# Altium schematic sheet ip_phone_c_codec.SchDoc: CODEC
size A3; Organization: Instituto Atlântico; Address1: Rua Chico Lemos, 946; Address2: Cidade dos Funcionários; Address3: CEP: 60822-780; Address4: Fortaleza - CE; SheetNumber: 3; SheetTotal: 6
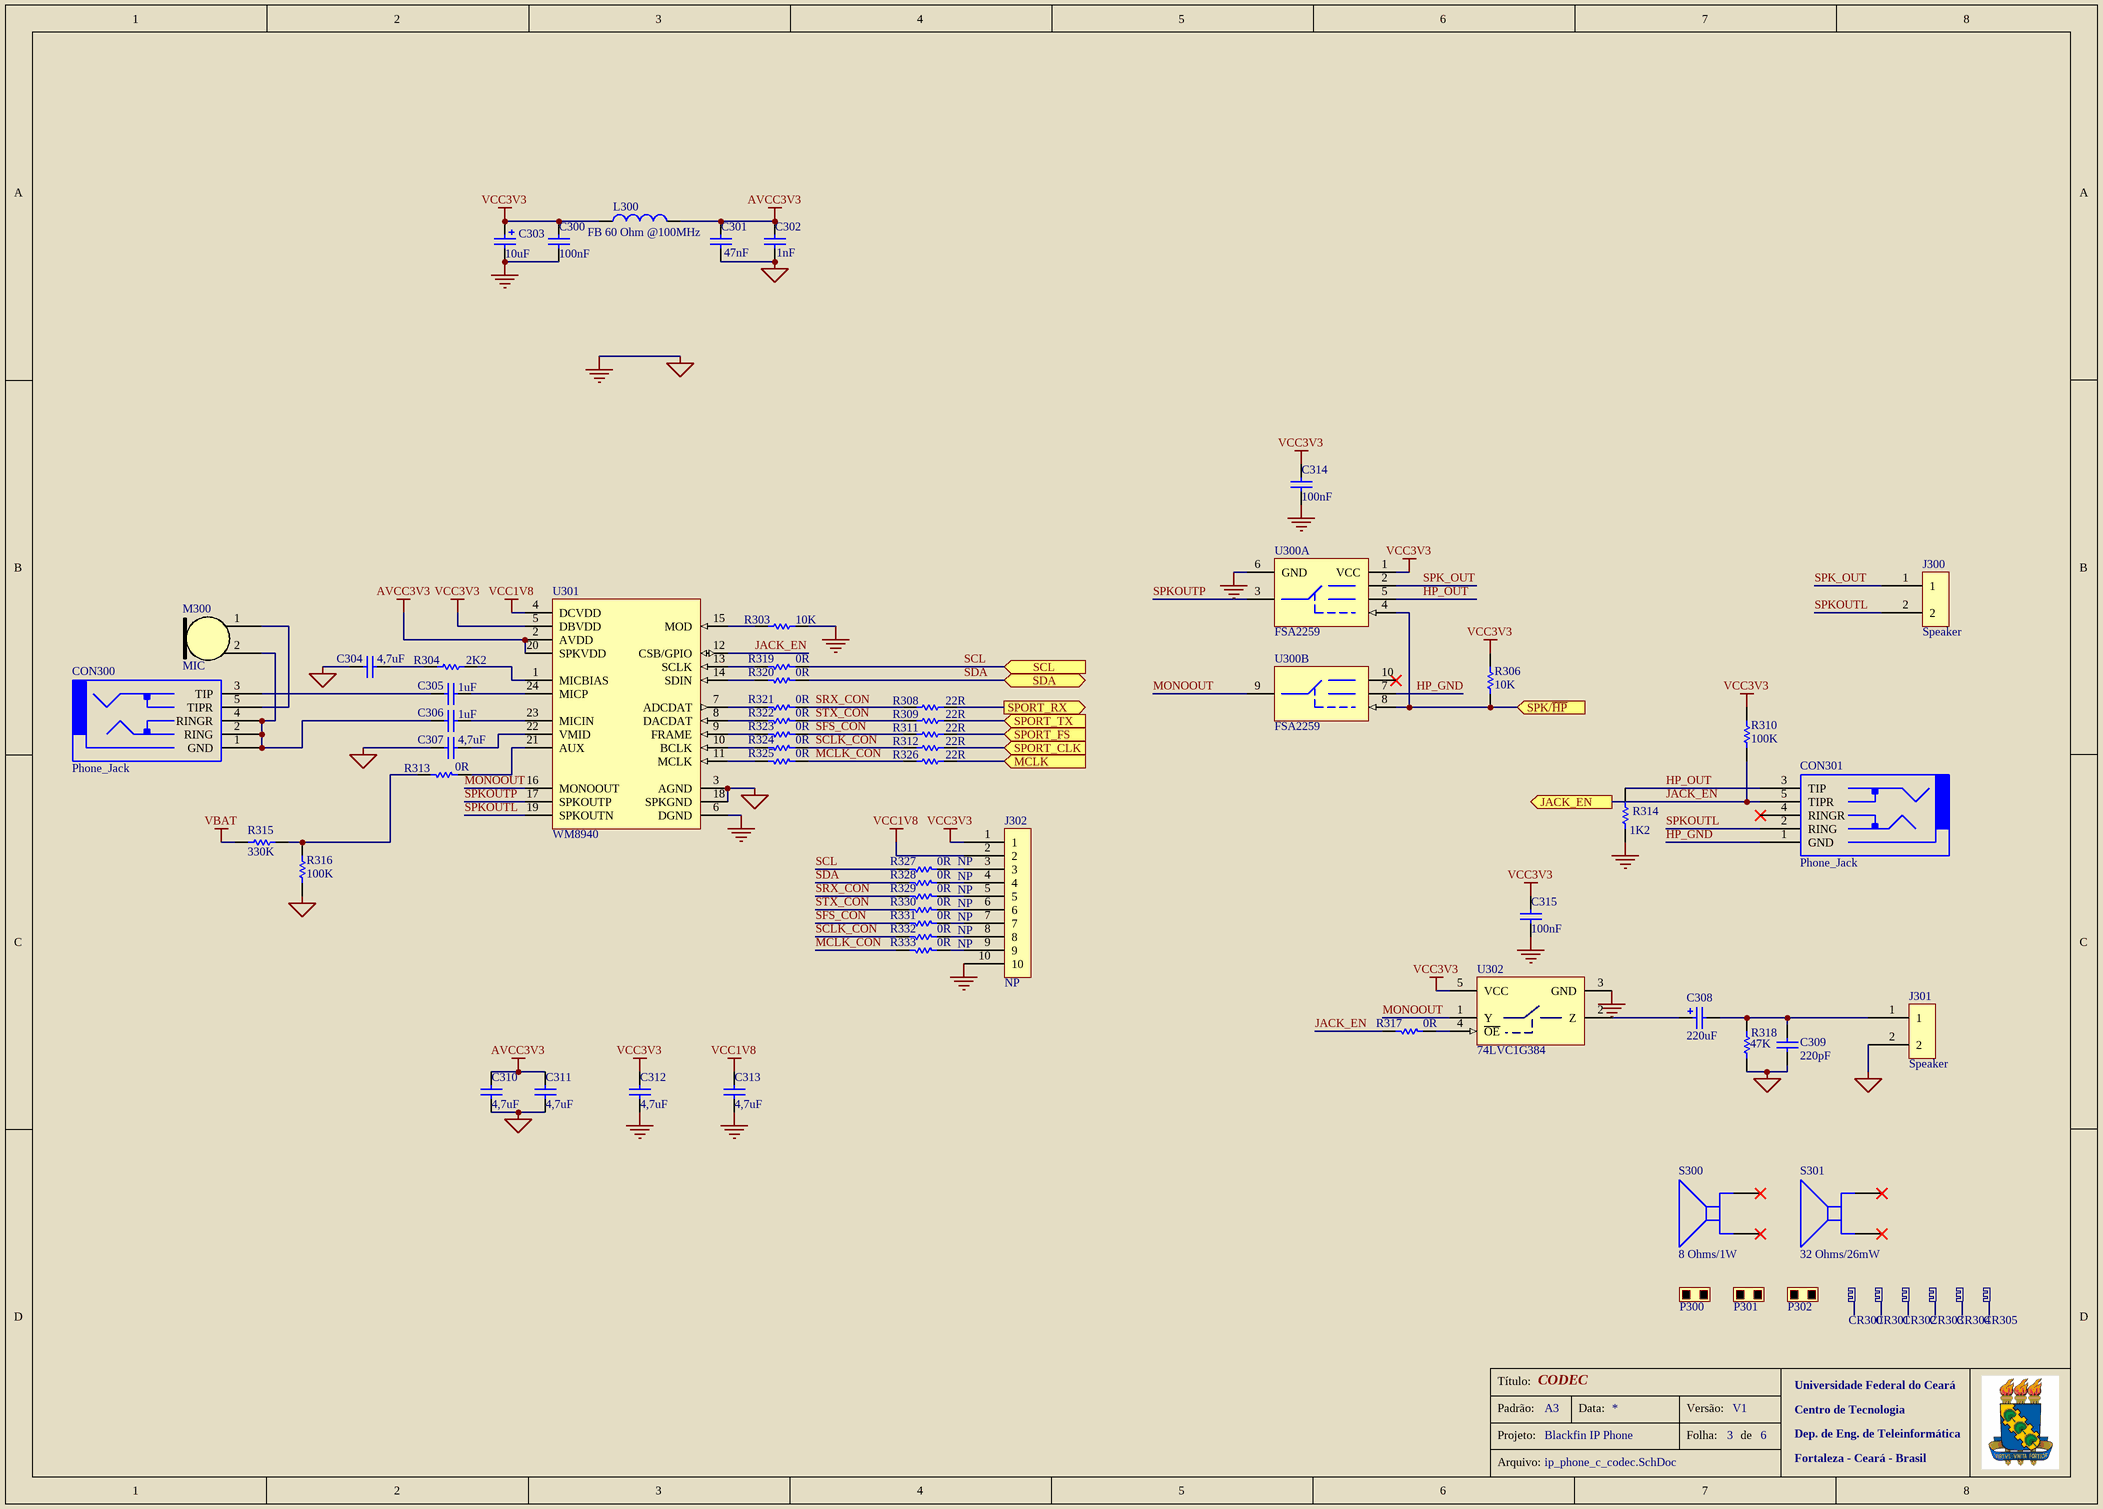
[diagram p0: ip_phone_c_codec.SchDoc]

## Parts
C300  100nF  [CC1005-0402]
C301  47nF  [CC1005-0402]
C302  1nF  [CC1005-0402]
C303  10uF  [VE-100M0JTR-0305]
C304  4,7uF  [CC1005-0402]
C305  1uF  [CC1005-0402]
C306  1uF  [CC1005-0402]
C307  4,7uF  [CC1005-0402]
C308  220uF
C309  220pF  [CC1005-0402]
C310  4,7uF  [CC1005-0402]
C311  4,7uF  [CC1005-0402]
C312  4,7uF  [CC1005-0402]
C313  4,7uF  [CC1005-0402]
C314  100nF  [CC1005-0402]
C315  100nF  [CC1005-0402]
CON300  Phone_Jack  [Phone_Jack]
CON301  Phone_Jack  [Phone_Jack]
CR300  Crimp  (value not drawn)  (mechanical)
CR301  Crimp  (value not drawn)  (mechanical)
CR302  Crimp  (value not drawn)  (mechanical)
CR303  Crimp  (value not drawn)  (mechanical)
CR304  Crimp  (value not drawn)  (mechanical)
CR305  Crimp  (value not drawn)  (mechanical)
J300  Speaker  [CON_IL-Z-2PL]
J301  Speaker  [CON_IL-Z-2PL]
J302  CONN HEADER  [CONECTOR_10_PIN]  (value not drawn)
L300  FB 60 Ohm @100MHz  [INDUTOR_0603]
M300  MIC  [CON_IL-Z-2PL]
P300  Socket Housing  (value not drawn)  (mechanical)
P301  Socket Housing  (value not drawn)  (mechanical)
P302  Socket Housing  (value not drawn)  (mechanical)
R303  10K  [CR1005-0402]
R304  2K2  [CR1005-0402]
R306  10K  [CR1005-0402]
R308  22R  [CR1005-0402]
R309  22R  [CR1005-0402]
R310  100K  [CR1005-0402]
R311  22R  [CR1005-0402]
R312  22R  [CR1005-0402]
R313  0R  [CR1005-0402]
R314  1K2  [CR1005-0402]
R315  330K  [CR1005-0402]
R316  100K  [CR1005-0402]
R317  0R  [CR1005-0402]
R318  47K  [CR1005-0402]
R319  0R  [CR1005-0402]
R320  0R  [CR1005-0402]
R321  0R  [CR1005-0402]
R322  0R  [CR1005-0402]
R323  0R  [CR1005-0402]
R324  0R  [CR1005-0402]
R325  0R  [CR1005-0402]
R326  22R  [CR1005-0402]
R327  0R  [CR1005-0402]
R328  0R  [CR1005-0402]
R329  0R  [CR1005-0402]
R330  0R  [CR1005-0402]
R331  0R  [CR1005-0402]
R332  0R  [CR1005-0402]
R333  0R  [CR1005-0402]
S300  8 Ohms/1W  (mechanical)
S301  32 Ohms/26mW  (mechanical)
U300  FSA2259  [QFN-10FSA]  (parts A,B of 2)
U301  WM8940  [QFN24]
U302  74LVC1G384  [SOT753]

## Ports
JACK_EN (out), MCLK (in), SCL (in), SDA (bidir), SPK/~{HP} (in), SPORT_CLK (in), SPORT_FS (in), SPORT_RX (out), SPORT_TX (in)

## Nets
AGND: C300.1 C301.1 C302.1 C303.2 C304.1 C307.1 C309.1 C310.2 C311.2 C312.2 C313.2 C314.1 C315.1 J301.2 J302.10 R303.2 R314.2 R316.1 R318.2 U300.6(GND) U301.3(AGND) U301.6(DGND) U301.18(SPKGND) U302.3(GND)  [also labelled GND]
AVCC3V3: C301.2 C302.2 C310.1 C311.1 L300.2 U301.2(AVDD) U301.20(SPKVDD)
VBAT: R315.1
VCC1V8: C313.1 J302.2 U301.4(DCVDD)
VCC3V3: C300.2 C303.1 C312.1 C314.2 C315.2 J302.1 L300.1 R306.2 R310.2 U300.1(VCC) U301.5(DBVDD) U302.5(VCC)
HP_GND: CON301.1(GND) U300.7(2B0)
HP_OUT: CON301.3(TIP) R314.1 U300.5(1B0)
JACK_EN: CON301.5(TIPR) R310.1 R317.2 U301.12(CSB/GPIO) ; port JACK_EN
MCLK: R326.2 ; port MCLK
MCLK_CON: R325.1 R326.1 R333.2
MONOOUT: U300.9(2A) U301.16(MONOOUT) U302.1(Y)
SCL: R319.1 R327.2 ; port SCL
SCLK_CON: R312.1 R324.1 R332.2
SDA: R320.1 R328.2 ; port SDA
SFS_CON: R311.1 R323.1 R331.2
SPK/~{HP}: R306.1 U300.4(S1) U300.8(S2) ; port SPK/~{HP}
SPK_OUT: J300.1 U300.2(1B1)
SPKOUTL: CON301.2(RING) J300.2 U301.19(SPKOUTN)
SPKOUTP: U300.3(1A) U301.17(SPKOUTP)
SPORT_CLK: R312.2 ; port SPORT_CLK
SPORT_FS: R311.2 ; port SPORT_FS
SPORT_RX: R308.2 ; port SPORT_RX
SPORT_TX: R309.2 ; port SPORT_TX
SRX_CON: R308.1 R321.1 R329.2
STX_CON: R309.1 R322.1 R330.2
NetC304_2: C304.2 R304.1
NetC305_1: C305.1 U301.24(MICP)
NetC305_2: C305.2 CON300.3(TIP)
NetC306_1: C306.1 U301.23(MICIN)
NetC306_2: C306.2 CON300.1(GND) CON300.2(RING) CON300.4(RINGR) M300.2(GND)
NetC307_2: C307.2 U301.22(VMID)
NetC308_1: C308.1 U302.2(Z)
NetC308_2: C308.2 C309.2 J301.1 R318.1
NetCON300_5: CON300.5(TIPR) M300.1(OUT)
NetJ302_3: J302.3 R327.1
NetJ302_4: J302.4 R328.1
NetJ302_5: J302.5 R329.1
NetJ302_6: J302.6 R330.1
NetJ302_7: J302.7 R331.1
NetJ302_8: J302.8 R332.1
NetJ302_9: J302.9 R333.1
NetR303_1: R303.1 U301.15(MOD)
NetR304_2: R304.2 U301.1(MICBIAS)
NetR313_1: R313.1 U301.21(AUX)
NetR313_2: R313.2 R315.2 R316.2
NetR317_1: R317.1 U302.4(~{OE})
NetR319_2: R319.2 U301.13(SCLK)
NetR320_2: R320.2 U301.14(SDIN)
NetR321_2: R321.2 U301.7(ADCDAT)
NetR322_2: R322.2 U301.8(DACDAT)
NetR323_2: R323.2 U301.9(FRAME)
NetR324_2: R324.2 U301.10(BCLK)
NetR325_2: R325.2 U301.11(MCLK)

Not connected (* = marked no-connect by the designer): CON301 4(RINGR)*; S300 1(CKT1)* 2(CKT2)*; S301 1(CKT1)* 2(CKT2)*; U300 10(2B1)*

## Notes on the sheet
- Título:
- Universidade Federal do Ceará
- Padrão:
- Projeto:
- A3
- Blackfin IP Phone
- Data:
- Versão:
- Folha:
- V1
- de
- Centro de Tecnologia
- Dep. de Eng. de Teleinformática
- Fortaleza - Ceará - Brasil
- Arquivo:

## Library data of the parts
C300 = Capacitor: MLCC - SMD/SMT 100nF 16V 10% 0402; eVendorPart#: 810-C1005X7R1C104K; Manufacturer: TDK; Part#: C1005X7R1C104KT; eVendor: Mouser; eVendorPrice: 0,03; MSRP: 0,005; MOQ: 1000
C301 = Capacitor: MLCC - SMD/SMT 47nF 16V 10% 0402; eVendorPart#: 311-1334-1-ND; Manufacturer: Yageo; Part#: CC0402KRX7R6BB473; eVendor: Digikey; eVendorPrice: 0,02; MSRP: 0,00429; MOQ: 1000
C302 = Capacitor: MLCC - SMD/SMT 1nF 16V 10% 0402; eVendorPart#: 311-1352-1-ND; Manufacturer: Yageo; Part#: CC0402KRX7R7BB102; eVendor: Digikey; eVendorPrice: 0,015; MSRP: 0,00335; MOQ: 1000
C303 = Capacitor_Electrolytic: Aluminum Electrolytic Capacitors - SMD 6.3 Volts 10uF 20%; eVendorPart#: 140-VE100M0JTR0305; Manufacturer: Lelon; eVendor: Mouser; MSRP: 0,099; eVendorPrice: 0,18; Part#: VE-100M0JTR-0305; MOQ: 1000
C304 C307 C310-C313 = Capacitor: MLCC - SMD/SMT 4.7uF 20% 6.3Volts 0402; eVendorPart#: 810-C1005X5R0J475M; Manufacturer: TDK; Part#: C1005X5R0J475MT; eVendor: Mouser; eVendorPrice: 0,22; MSRP: 0,108; MOQ: 1000
C305 C306 = Capacitor: CAP CER 1.0UF 6.3V 20% X5R 0402; eVendorPart#: 490-1319-1-ND; Manufacturer: Murata Electronics North America; Part#: GRM155R60J105ME19D; eVendor: Digikey; eVendorPrice: 0,055; MSRP: 0,01193; MOQ: 1000
C308 = Capacitor_Electrolytic: Tantalum Capacitor - SMD 6.3 Volts 220uF 10%; eVendorPart#: 80-T491D227K006; Part#: T491D227K006AT; Manufacturer: Kemet; eVendor: Mouser; MSRP: 0,44; eVendorPrice: 1,28; MOQ: 1000
C309 = Capacitor: Capacitor 220pF 0402; eVendorPart#: 311-1035-1-ND; Manufacturer: Yageo; Part#: CC0402KRX7R9BB221; eVendor: Digikey; eVendorPrice: 0,015; MSRP: 0,00335; MOQ: 1000
C314 C315 = Capacitor: MLCC - SMD/SMT 0.1UF 16V 10% 0402; eVendorPart#: 810-C1005X7R1C104K; Manufacturer: TDK; Part#: C1005X7R1C104KT; eVendor: Mouser; eVendorPrice: 0,03; MSRP: 0,005; MOQ: 1000
CON300 CON301 = Phone_Jack_1: eVendorPart#: CP1-2535SJCT-ND; Manufacturer: CUI Inc; Part#: SJ1-2535-SMT; eVendorPrice: 0,75; eVendor: Digikey; MSRP: 0,415; MOQ: 1000
CR300-CR305 = Crimp: Socket Crimp; eVendorPart#: 656-ILZC3A115000; Part#: IL-Z-C3-A-1-15000; Manufacturer: JAE Electronics; eVendor: Mouser; eVendorPrice: 0,05; MSRP: 0,049; MOQ: 1000
J300 J301 = Speaker_con: Connector 2 Pin 1.25mm Male; eVendorPart#: 656-IL-Z-2PL-SMTYE; Manufacturer: JAE Electronics; Part#: IL-Z-2PL-SMTYE; eVendor: Mouser; eVendorPrice: 0,33; MSRP: 0,22; MOQ: 1000
J302 = Conector 10pin: CONN HEADER .050" 10POS PCB GOLD; eVendorPart#: S9014E-10-ND; Manufacturer: Sullins Connector Solutions; Part#: GRPB101VWVN-RC; eVendor: Digikey; eVendorPrice: 0,66; MSRP: 0,32775; MOQ: 1000; NP: NP
L300 = Inductor: Ferrite Bead 60 Ohm @100MHz; eVendorPart#: 667-EXC-3BP600H; Manufacturer: Panasonic Electronic Components; Part#: EXC-3BP600H; eVendor: Mouser; eVendorPrice: 0,11; MSRP: 0,066; MOQ: 1000
M300 = MIC: Microphones -38DB 2VDC .5MA 2.2KOHM; Part#: POM-2738P-C33-R; Manufacturer: PUI Audio; eVendorPart#: 665-POM2738PC33R; eVendor: Mouser; eVendorPrice: 1,98; MSRP: 1,13; MOQ: 500
P300-P302 = Socket Housing: Socket Housing 1.25mm 2 Pins; eVendorPart#: 656-IL-Z-2S-S125C3; Part#: IL-Z-2S-S125C3; Manufacturer: JAE Electronics; eVendor: Mouser; eVendorPrice: 0,11; MSRP: 0,042; MOQ: 1000
R303 R306 = Resistor: Thick Film Resistors SMD 0402 10K 5%  1/16 W; eVendorPart#: 311-10KJRCT-ND; Manufacturer: Yageo; Part#: RC0402JR-0710KL; eVendor: Digikey; eVendorPrice: 0,012; MSRP: 0,00253; MOQ: 1000
R304 = Resistor: Thick Film Resistors SMD 0402 2K2 5%  1/16 W; eVendorPart#: 311-2.2KJRCT-ND; Manufacturer: Yageo; Part#: RC0402JR-072K2L; eVendor: Digikey; eVendorPrice: 0,012; MSRP: 0,00253; MOQ: 1000
R308 R309 R311 R312 R326 = Resistor: Thick Film Resistors SMD 0402 22R 5%  1/16 W; eVendorPart#: 71-CRCW0402J-22-E3; Manufacturer: Vishay/Dale; Part#: CRCW040222R0JNED; eVendor: Mouser; eVendorPrice: 0,08; MSRP: 0,015; MOQ: 1000
R310 R316 = Resistor: Thick Film Resistors SMD 0402 100K 5%  1/16 W; eVendorPart#: 311-100KJRCT-ND; Manufacturer: Yageo; Part#: RC0402JR-07100KL; eVendor: Digikey; eVendorPrice: 0,012; MSRP: 0,00253; MOQ: 1000
R313 R317 R319-R325 R327-R333 = Resistor: Thick Film Resistors 0402 1/16W Jumper; eVendorPart#: 667-ERJ-2GE0R00X; Manufacturer: Panasonic Electronic Components; Part#: ERJ-2GE0R00X; eVendor: Mouser; eVendorPrice: 0,05; MSRP: 0,004; MOQ: 1000
  R327-R333: NP: NP
R314 = Resistor: Thick Film Resistors SMD 0402 1K2 5%  1/16 W; eVendorPart#: 311-1.2KJRCT-ND; Manufacturer: Yageo; Part#: RC0402JR-071K2L; eVendor: Digikey; eVendorPrice: 0,012; MSRP: 0,00253; MOQ: 1000
R315 = Resistor: Thick Film Resistor 330K 1% 1/16W; eVendorPart#: RMCF0402FT330KCT-ND; Manufacturer: Stackpole Electronics Inc; Part#: RMCF0402FT330K; eVendor: Digikey; eVendorPrice: 0,04; MSRP: 0,00384; MOQ: 1000
R318 = Resistor: Thick Film Resistors SMD 0402 47K 5%  1/16 W; eVendorPart#: 311-47KJRCT-ND; Manufacturer: Yageo; Part#: RC0402JR-0747KL; eVendor: Digikey; eVendorPrice: 0,012; MSRP: 0,00253; MOQ: 1000
S300 = Speaker: Speaker 8 Ohms 1W; eVendorPart#: 254-DS238-RO; Manufacturer: Kobitone; eVendor: Mouser; eVendorPrice: 2,25; MSRP: 1,32; Part#: 254-DS238-RO; MOQ: 1000
S301 = Receiver: Dynamic Receiver 32Ohms 26mW 115dB 13mm D; eVendorPart#: 254-DR132-RO; manufacturer: Kobitone; eVendor: Mouser; eVendorPrice: 1,98; MSRP: 1,52; MOQ: 1000; Part#: 254-DR132-RO
U300 = FSA2259: Analog Switch, Dual SPDT; eVendorPart#: 512-FSA2259UMX; Manufacturer: Fairchild Semiconductor; Part#: FSA2259UMX; eVendor: Mouser; eVendorPrice: 0,68; MSRP: 0,22; MOQ: 1000
U301 = WM8940: Mono Audio CODEC; eVendorPart#: 238-WM8940GEFL/V; Part#: WM8940GEFL/V; Manufacturer: Wolfson Microelectronics; eVendor: Mouser; eVendorPrice: 2,82; MSRP: 1,70; MOQ: 1000
U302 = 74LVC1G384: Low Voltage SPST Analog Switch; eVendorPart#: 771-LVC1G384GV125; Part#: 74LVC1G384GV,125; Manufacturer: NXP Semiconductors; eVendor: Mouser; eVendorPrice: 0,07; MSRP: 0,046; MOQ: 1000